# Altium schematic sheet Sensors_flying_pcb.SchDoc
size A4
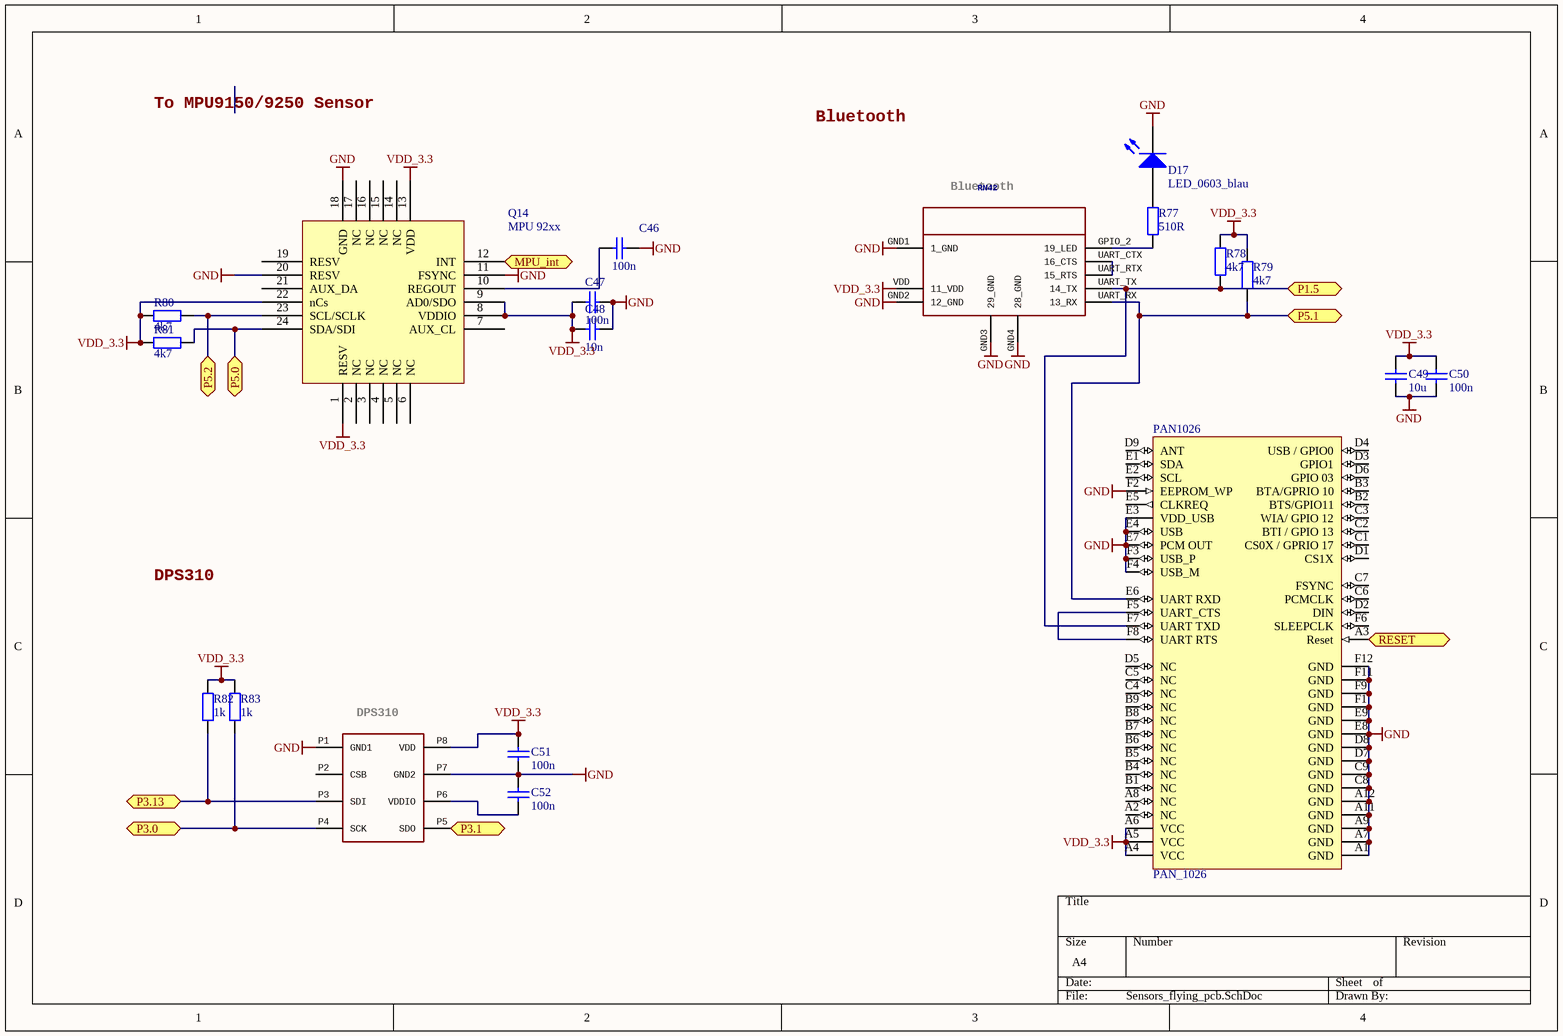
[diagram p0: Sensors_flying_pcb.SchDoc]

## Parts
C46  100n  [_0603]
C47  100n  [_0603]
C48  10n  [_0603]
C49  10u  [_0603]
C50  100n  [_0603]
C51  100n  [_0603]
C52  100n  [_0603]
D17  LED_0603_blau  [LED_0603]
DPS310  Infineon  [LGA8R125P0X4_500X300X120]  (value not drawn)
PAN1026  PAN_1026  [LGA49C120P12X6_1560X870X180]
Q14  MPU 92xx  [PQFN40P300X300X100_HS-25M]
R77  510R  [_0603]
R78  4k7  [_0603]
R79  4k7  [_0603]
R80  4k7  [_0603]
R81  4k7  [_0603]
R82  1k  [_0603]
R83  1k  [_0603]
RN42  >NAME: RN42  [RN42+SHIELD]  (hidden comment: n.m.)

## Ports
MPU_int, P1.5, P3.0, P3.1, P3.13, P5.0, P5.1, P5.2, RESET

## Nets
GND: C46.1 C47.1 C48.1 C49.1 C50.1 C51.1 C52.1 D17.2 DPS310.P1(GND1) DPS310.P7(GND2) PAN1026.A1(GND) PAN1026.A7(GND) PAN1026.A9(GND) PAN1026.A11(GND) PAN1026.A12(GND) PAN1026.C8(GND) PAN1026.C9(GND) PAN1026.D7(GND) PAN1026.D8(GND) PAN1026.E3(VDD_USB) PAN1026.E4(USB) PAN1026.E7(PCM_OUT) PAN1026.E8(GND) PAN1026.E9(GND) PAN1026.F1(GND) PAN1026.F2(EEPROM_WP) PAN1026.F3(USB_P) PAN1026.F4(USB_M) PAN1026.F9(GND) PAN1026.F11(GND) PAN1026.F12(GND) Q14.11(FSYNC) Q14.18(GND) Q14.20(RESV) RN42.GND1(1_GND) RN42.GND2(12_GND) RN42.GND3(29_GND) RN42.GND4(28_GND)
VDD_3.3: C47.2 C48.2 C49.2 C50.2 C51.2 DPS310.P8(VDD) PAN1026.A4(VCC) PAN1026.A5(VCC) PAN1026.A6(VCC) Q14.1(RESV) Q14.8(VDDIO) Q14.9(AD0/SDO) Q14.13(VDD) Q14.22(nCs) R78.1 R79.1 R80.2 R81.2 R82.2 R83.2 RN42.VDD(11_VDD)
MPU_int: Q14.12(INT) ; port MPU_int
P1.5: PAN1026.F7(UART_TXD) R78.2 RN42.UART_TX(14_TX) ; port P1.5
P3.0: DPS310.P4(SCK) R83.1 ; port P3.0
P3.1: DPS310.P5(SDO) ; port P3.1
P3.13: DPS310.P3(SDI) R82.1 ; port P3.13
P5.0: Q14.24(SDA/SDI) R81.1 ; port P5.0
P5.1: PAN1026.E6(UART_RXD) R79.2 RN42.UART_RX(13_RX) ; port P5.1
P5.2: Q14.23(SCL/SCLK) R80.1 ; port P5.2
RESET: PAN1026.A3(Reset) ; port RESET
NetC46_2: C46.2 Q14.10(REGOUT)
NetC52_2: C52.2 DPS310.P6(VDDIO)
NetD17_1: D17.1 R77.1
NetPAN1026_F5: PAN1026.F5(UART_CTS) PAN1026.F8(UART_RTS)
NetR77_2: R77.2 RN42.GPIO_2(19_LED)
NetRN42_UART_CTX: RN42.UART_CTX(16_CTS) RN42.UART_RTX(15_RTS)

Not connected (* = marked no-connect by the designer): DPS310 P2(CSB); PAN1026 A2(NC) A8(NC) B1(NC) B2(BTS/GPIO11) B3(BTA/GPRIO_10) B4(NC) B5(NC) B6(NC) B7(NC) B8(NC) B9(NC) C1(CS0X_/_GPRIO_17) C2(BTI_/_GPIO_13) C3(WIA/_GPIO_12) C4(NC) C5(NC) C6(PCMCLK) C7(FSYNC) D1(CS1X) D2(DIN) D3(GPIO1) D4(USB_/_GPIO0) D5(NC) D6(GPIO_03) D9(ANT) E1(SDA) E2(SCL) E5(CLKREQ) F6(SLEEPCLK); Q14 2(NC) 3(NC) 4(NC) 5(NC) 6(NC) 7(AUX_CL) 14(NC) 15(NC) 16(NC) 17(NC) 19(RESV) 21(AUX_DA)

## Notes on the sheet
- To MPU9150/9250 Sensor
- Bluetooth
- DPS310
- (near DPS310) DPS310

## Library data of the parts
C46-C52 = Cap_129: Name: Cap_0603; QR: 0; UID: Cap_129; ComponentLink1URL: #NAME?; mounting: SMD
D17 = DIODE_60: Type: LED; Colour: blau; RS_number: 697-3610P; QR: 0; UID: DIODE_60; Name: LED_0603_blau; Name_Hyperlink: http://at.rs-online.com/web/p/products/6973610P/; ComponentLink1URL: #WERT!; mounting: SMD
DPS310 = DPS310DRUCKSENSOR
R77-R83 = Res_5: Name: Res_0603; UID: Res_5; ComponentLink1URL: #NAME?; mounting: SMD
RN42 = BLUETOOTHRN42+SHIELD